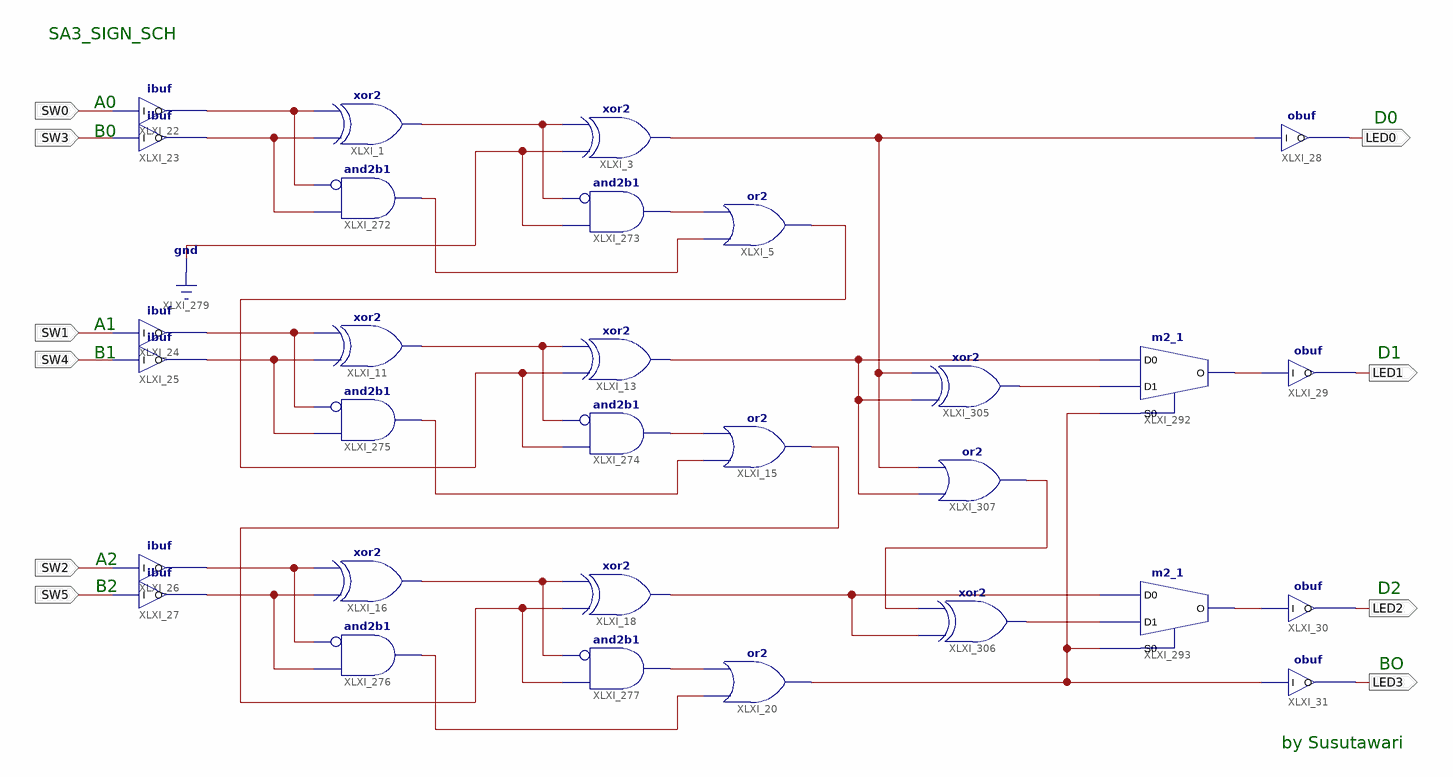
[diagram p0: schematic sheet 1]
// Xilinx ISE schematic SA3_SIGN_SCH.sch (spartan3a) as structural Verilog: 30 symbols, 10 ports
module SA3_SIGN_SCH (
  input  SW3,
  input  SW0,
  input  SW4,
  input  SW1,
  input  SW5,
  input  SW2,
  output LED2,
  output LED1,
  output LED3,
  output LED0
);

  wire XLXN_2, XLXN_4, XLXN_5, XLXN_7, XLXN_8, XLXN_16, XLXN_17, XLXN_18, XLXN_20, XLXN_21, XLXN_22, XLXN_23,
       XLXN_24, XLXN_25, XLXN_27, XLXN_28, XLXN_29, XLXN_32, XLXN_33, XLXN_65, XLXN_94, XLXN_95, XLXN_96,
       XLXN_107, XLXN_108, XLXN_109;

  xor XLXI_1 (XLXN_5, XLXN_4, XLXN_2);
  xor XLXI_3 (XLXN_95, 1'b0, XLXN_5);
  or XLXI_5 (XLXN_20, XLXN_8, XLXN_7);
  xor XLXI_11 (XLXN_18, XLXN_17, XLXN_16);
  xor XLXI_13 (XLXN_96, XLXN_20, XLXN_18);
  or XLXI_15 (XLXN_27, XLXN_22, XLXN_21);
  xor XLXI_16 (XLXN_25, XLXN_24, XLXN_23);
  xor XLXI_18 (XLXN_109, XLXN_27, XLXN_25);
  or XLXI_20 (XLXN_65, XLXN_29, XLXN_28);
  ibuf XLXI_22 (.I(SW0), .O(XLXN_2));
  ibuf XLXI_23 (.I(SW3), .O(XLXN_4));
  ibuf XLXI_24 (.I(SW1), .O(XLXN_16));
  ibuf XLXI_25 (.I(SW4), .O(XLXN_17));
  ibuf XLXI_26 (.I(SW2), .O(XLXN_23));
  ibuf XLXI_27 (.I(SW5), .O(XLXN_24));
  and XLXI_272 (XLXN_8, ~XLXN_2, XLXN_4);  // and2b1
  and XLXI_273 (XLXN_7, ~XLXN_5, 1'b0);  // and2b1
  and XLXI_274 (XLXN_21, ~XLXN_18, XLXN_20);  // and2b1
  and XLXI_275 (XLXN_22, ~XLXN_16, XLXN_17);  // and2b1
  and XLXI_276 (XLXN_29, ~XLXN_23, XLXN_24);  // and2b1
  and XLXI_277 (XLXN_28, ~XLXN_25, XLXN_27);  // and2b1
  xor XLXI_305 (XLXN_94, XLXN_96, XLXN_95);
  or XLXI_307 (XLXN_107, XLXN_96, XLXN_95);
  m2_1 XLXI_293 (.D0(XLXN_109), .D1(XLXN_108), .S0(XLXN_65), .O(XLXN_32));
  obuf XLXI_30 (.I(XLXN_32), .O(LED2));
  m2_1 XLXI_292 (.D0(XLXN_96), .D1(XLXN_94), .S0(XLXN_65), .O(XLXN_33));
  obuf XLXI_29 (.I(XLXN_33), .O(LED1));
  obuf XLXI_31 (.I(XLXN_65), .O(LED3));
  obuf XLXI_28 (.I(XLXN_95), .O(LED0));
  xor XLXI_306 (XLXN_108, XLXN_109, XLXN_107);

  // Notes on the sheet:
  //   SA3_SIGN_SCH
  //   A0
  //   D0
  //   B0
  //   A1
  //   B1
  //   D1
  //   A2
  //   B2
  //   D2
  //   BO
  //   by Susutawari
endmodule
